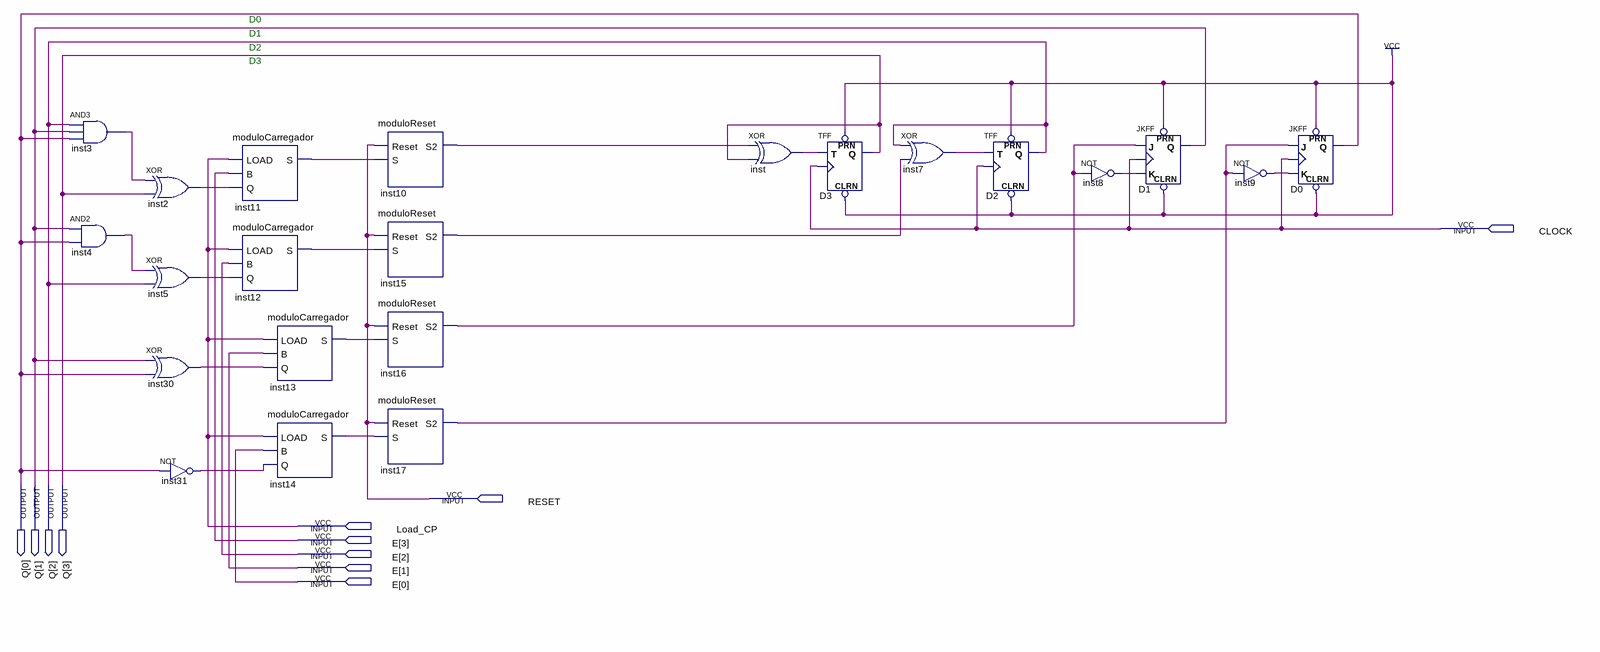
[diagram p0: schematic sheet]
// Quartus schematic Reset.bdf as structural Verilog: 22 symbols, 11 pins
module Reset (
  input  CLOCK,
  input  RESET,
  input  Load_CP,
  input  [3:0] E,
  output [3:0] Q
);

  wire inst2_out, inst3_out, inst4_out, inst5_out, inst7_out, inst8_out, inst9_out, inst10_s2, inst11_s,
       inst12_s, inst13_s, inst14_s, inst15_s2, inst16_s2, inst17_s2, inst30_out, inst31_out, inst_out;

  and inst3 (inst3_out, Q[2], Q[1], Q[0]);
  and inst4 (inst4_out, Q[1], Q[0]);
  xor inst2 (inst2_out, inst3_out, Q[3]);
  xor inst5 (inst5_out, inst4_out, Q[2]);
  xor inst30 (inst30_out, Q[1], Q[0]);
  not inst31 (inst31_out, Q[0]);
  moduloCarregador inst11 (.LOAD(Load_CP), .B(E[3]), .Q(inst2_out), .S(inst11_s));
  moduloCarregador inst12 (.LOAD(Load_CP), .B(E[2]), .Q(inst5_out), .S(inst12_s));
  moduloCarregador inst13 (.LOAD(Load_CP), .B(E[1]), .Q(inst30_out), .S(inst13_s));
  moduloCarregador inst14 (.LOAD(Load_CP), .B(E[0]), .Q(inst31_out), .S(inst14_s));
  moduloReset inst10 (.Reset(RESET), .S(inst11_s), .S2(inst10_s2));
  moduloReset inst15 (.Reset(RESET), .S(inst12_s), .S2(inst15_s2));
  moduloReset inst16 (.Reset(RESET), .S(inst13_s), .S2(inst16_s2));
  moduloReset inst17 (.Reset(RESET), .S(inst14_s), .S2(inst17_s2));
  xor inst (inst_out, inst10_s2, Q[3]);
  TFF D3 (.PRN(1'b1), .CLRN(1'b1), .T(inst_out), .CLK(CLOCK), .Q(Q[3]));
  xor inst7 (inst7_out, Q[2], inst15_s2);
  TFF D2 (.PRN(1'b1), .CLRN(1'b1), .T(inst7_out), .CLK(CLOCK), .Q(Q[2]));
  not inst8 (inst8_out, inst16_s2);
  JKFF D1 (.PRN(1'b1), .CLRN(1'b1), .K(inst8_out), .J(inst16_s2), .CLK(CLOCK), .Q(Q[1]));
  not inst9 (inst9_out, inst17_s2);
  JKFF D0 (.PRN(1'b1), .CLRN(1'b1), .K(inst9_out), .J(inst17_s2), .CLK(CLOCK), .Q(Q[0]));

  // Notes on the sheet:
  //   D0
  //   D1
  //   D2
  //   D3
endmodule
